# Altium project DD2088PoE_Daisy_Chain.PrjPcb (part 8 of 8)
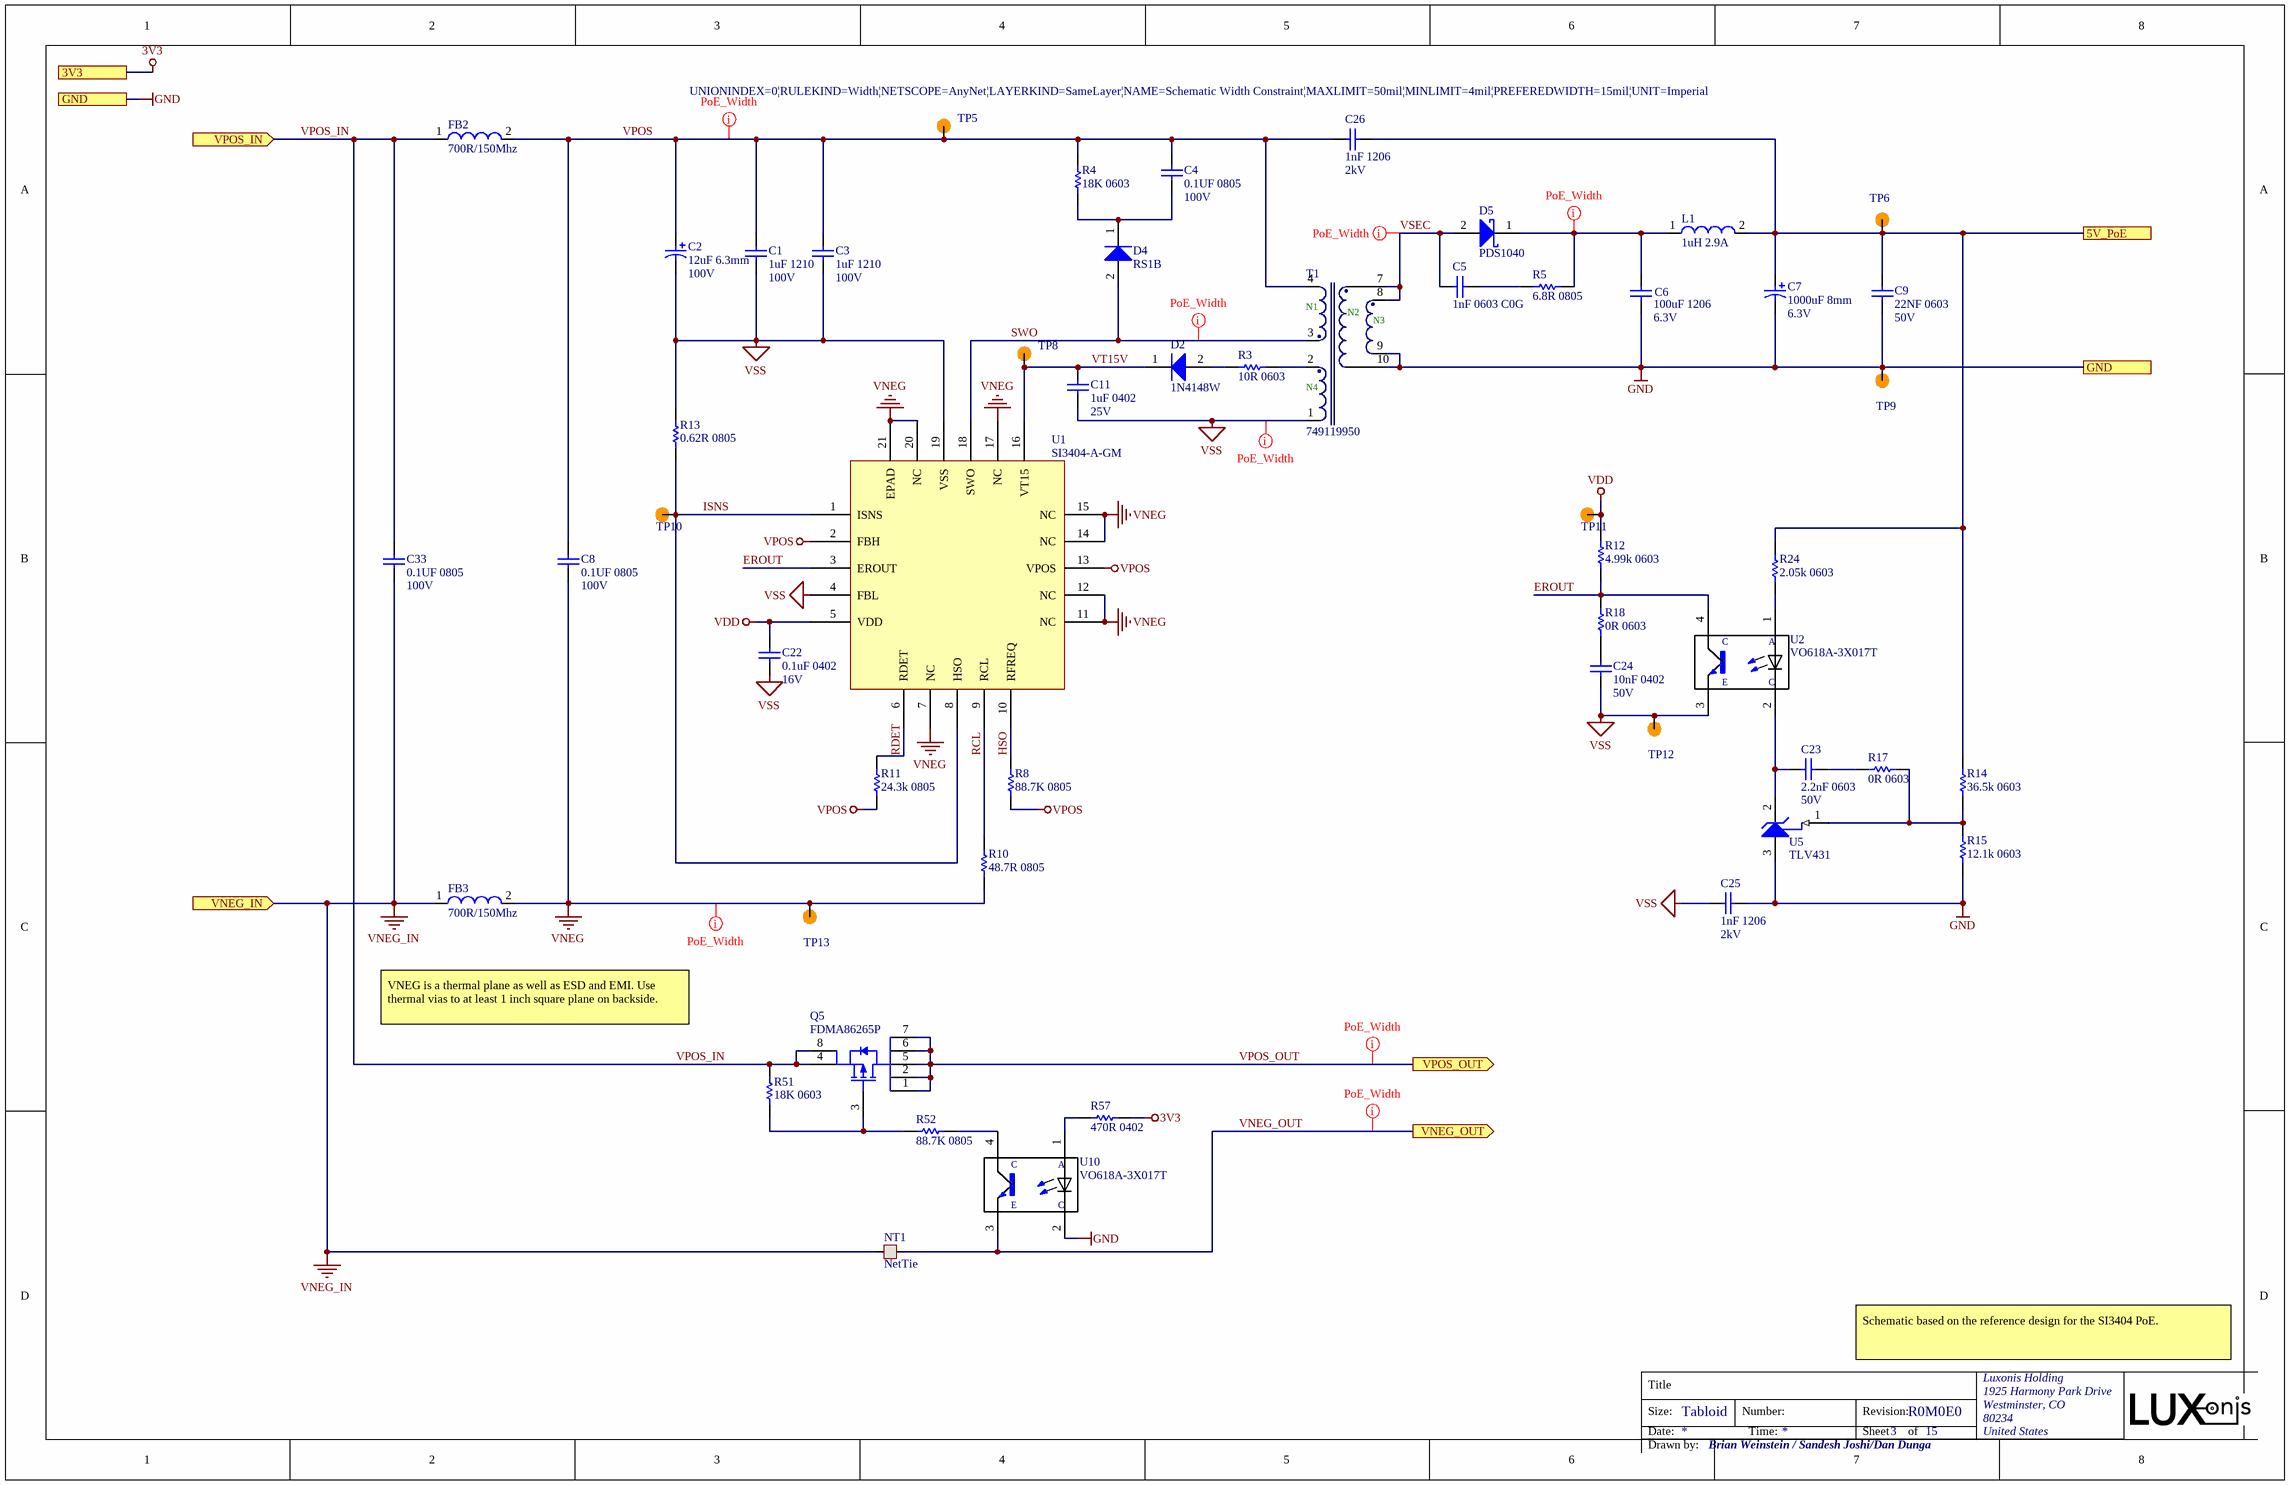
[diagram p16: PoE_Si3404.SchDoc]

## Sheet PoE_Si3404.SchDoc: =project_title (continued)

### Library data of the parts (continued)
R10 = RC0805FR-0748R7L: RES SMD 48.7 OHM 1% 1/8W 0805; Manufacturer 1: Yageo; Temperature Coefficient: 100ppm/°C; Power Rating: 125mW; Voltage Rating: 150V; Supplier 1: Digi-Key; Manufacturer Part Number 1: RC0805FR-0748R7L; Stock 1: 11096; Pricing 1: 1=0.10000, 10=0.04000, 100=0.01630, 1000=0.00731, 2500=0.00635 (USD); RoHS: Yes; Case/Package: 0805; Contact Plating: Tin,Matte; Case Code (Metric): 2012; Case Code (Imperial): 0805; Min Operating Temperature: -55°C; Max Operating Temperature: 155°C; Resistance: 48.7R; Tolerance: 1%; Composition: Thick Film; Package Quantity: 1; Packaging: Tape and Reel; Number of Terminations: 2; Termination: SMD/SMT; Military Standard: Not; Max Power Dissipation: 125mW; Voltage Rating (DC): 150V; Features: Moisture Resistant; Length: 2mm; Height: 0.024inch; Width: 0.049inch; Depth: 1.25mm; Radiation Hardening: No; Lead Free: Lead Free; ComponentLink1URL: https://datasheet.ciiva.com/2457/pyu-r-int-thick-7-2457344.pdf?src-supplier=Digi-Key; ComponentLink1Description: https://datasheet.ciiva.com/2457/pyu-r-int-thick-7-2457344.pdf?src-supplier=Digi-Key; ComponentLink2URL: https://datasheet.ciiva.com/2457/pyu-r-int-thick-7-2457345.pdf?src-supplier=Digi-Key; ComponentLink2Description: https://datasheet.ciiva.com/2457/pyu-r-int-thick-7-2457345.pdf?src-supplier=Digi-Key; ComponentLink3URL: https://datasheet.ciiva.com/2457/pyu-r-int-thick-7-2457346.pdf?src-supplier=Digi-Key; ComponentLink3Description: https://datasheet.ciiva.com/2457/pyu-r-int-thick-7-2457346.pdf?src-supplier=Digi-Key; Supplier 2: Mouser; Supplier 3: Arrow; Supplier Part Number 1: 311-48.7CRCT-ND; Supplier Part Number 2: 603-RC0805FR-0748R7L; Supplier Part Number 3: RC0805FR-0748R7L
R11 = CRCW080524K3FKEA: RES SMD 24.3K OHM 1% 1/8W 0805; Manufacturer 1: Vishay; Resistance: 24.3kR; Temperature Coefficient: 100ppm/°C; Power Rating: 125mW; Voltage Rating: 150V; Supplier 1: Digi-Key; Manufacturer Part Number 1: CRCW080524K3FKEA; Stock 1: 7150; Pricing 1: 1=0.10000, 10=0.06200, 100=0.02540, 1000=0.01142, 2500=0.00991 (USD); RoHS: Yes; Mount: Surface Mount; Case/Package: 0805; Number of Pins: 2; Weight: 0.000194oz; Contact Plating: Tin; Case Code (Imperial): 0805; Case Code (Metric): 2012; Min Operating Temperature: -55°C; Max Operating Temperature: 155°C; Tolerance: 1%; Packaging: Tape and Reel; Composition: Thick Film; Package Quantity: 10; Termination: SMD/SMT; Number of Terminations: 2; Max Power Dissipation: 125mW; Features: Automotive AEC-Q200; Military Standard: Not; Voltage Rating (DC): 150V; Working Voltage: 150V; Length: 2mm; Height: 0.45mm; Width: 1.25mm; Depth: 1.25mm; Radiation Hardening: No; Lead Free: Lead Free; REACH SVHC: Unknown; ComponentLink1URL: https://datasheet.ciiva.com/11811/0900766b80d98b26-11811485.pdf?src-supplier=RSComponents; ComponentLink1Description: https://datasheet.ciiva.com/11811/0900766b80d98b26-11811485.pdf?src-supplier=RSComponents; ComponentLink2URL: https://datasheet.ciiva.com/5544/dcrcwe3-109170-5544277.pdf?src-supplier=Mouser; ComponentLink2Description: https://datasheet.ciiva.com/5544/dcrcwe3-109170-5544277.pdf?src-supplier=Mouser; ComponentLink3URL: https://datasheet.ciiva.com/2467/dcrcwe3-2467350.pdf?src-supplier=Digi-Key; ComponentLink3Description: https://datasheet.ciiva.com/2467/dcrcwe3-2467350.pdf?src-supplier=Digi-Key; ComponentLink4URL: https://datasheet.ciiva.com/3258/dcrcwe3-3258365.pdf?src-supplier=Avnet; ComponentLink4Description: https://datasheet.ciiva.com/3258/dcrcwe3-3258365.pdf?src-supplier=Avnet; ComponentLink5URL: https://datasheet.ciiva.com/2467/dcrcwe3-2467351.pdf?src-supplier=Digi-Key; ComponentLink5Description: https://datasheet.ciiva.com/2467/dcrcwe3-2467351.pdf?src-supplier=Digi-Key; ComponentLink6URL: https://datasheet.ciiva.com/2467/dcrcwe3-2467352.pdf?src-supplier=Digi-Key; ComponentLink6Description: https://datasheet.ciiva.com/2467/dcrcwe3-2467352.pdf?src-supplier=Digi-Key; ComponentLink7URL: https://datasheet.ciiva.com/22872/70201119-22872331.pdf?src-supplier=Allied+Electronics; ComponentLink7Description: https://datasheet.ciiva.com/22872/70201119-22872331.pdf?src-supplier=Allied+Electronics; ComponentLink8URL: https://datasheet.ciiva.com/3258/dcrcwe3-3258364.pdf?src-supplier=Avnet; ComponentLink8Description: https://datasheet.ciiva.com/3258/dcrcwe3-3258364.pdf?src-supplier=Avnet; ComponentLink9URL: https://datasheet.ciiva.com/17183/dcrcwe3-17183388.pdf?src-supplier=Avnet+Europe; ComponentLink9Description: https://datasheet.ciiva.com/17183/dcrcwe3-17183388.pdf?src-supplier=Avnet+Europe; ComponentLink10URL: https://datasheet.ciiva.com/22705/1697337-22705870.pdf?src-supplier=Element14; ComponentLink10Description: https://datasheet.ciiva.com/22705/1697337-22705870.pdf?src-supplier=Element14; ComponentLink11URL: https://datasheet.ciiva.com/16202/dcrcwe3-16202447.pdf?src-supplier=Future+Electronics; ComponentLink11Description: https://datasheet.ciiva.com/16202/dcrcwe3-16202447.pdf?src-supplier=Future+Electronics; Supplier 2: Newark; Supplier 3: Mouser; Supplier Part Number 1: 541-24.3KCCT-ND; Supplier Part Number 2: 53K0042; Supplier Part Number 3: 71-CRCW0805-24.3K-E3
R12 = RC0603FR-074K99L: RES SMD 4.99K OHM 1% 1/10W 0603; Manufacturer 1: Yageo; Resistance: 4.99kR; Temperature Coefficient: 100ppm/°C; Voltage Rating (DC): 50V; Power Rating: 100mW; Voltage Rating: 75V; Supplier 1: Digi-Key; Manufacturer Part Number 1: RC0603FR-074K99L; Stock 1: 4263956; Pricing 1: 1=0.10000, 10=0.02300, 100=0.00940, 1000=0.00421, 2500=0.00366 (USD); RoHS: Yes; Case/Package: 0603; Number of Pins: 2; Weight: 7.1E-05oz; Case Code (Imperial): 0603; Case Code (Metric): 1608; Min Operating Temperature: -55°C; Max Operating Temperature: 155°C; Tolerance: 1%; Packaging: Tape and Reel; Composition: Thick Film; Package Quantity: 1; Termination: SMD/SMT; Number of Terminations: 2; Military Standard: Not; Max Power Dissipation: 100mW; Features: Moisture Resistant; Length: 1.6mm; Height: 0.45mm; Width: 0.8mm; Depth: 0.8mm; Lead Free: Lead Free; REACH SVHC: Unknown; ComponentLink1URL: https://datasheet.ciiva.com/22747/443971-22747529.pdf?src-supplier=Element14; ComponentLink1Description: https://datasheet.ciiva.com/22747/443971-22747529.pdf?src-supplier=Element14; ComponentLink2URL: https://datasheet.ciiva.com/2453/pyu-r-int-thick-7-2453979.pdf?src-supplier=Digi-Key; ComponentLink2Description: https://datasheet.ciiva.com/2453/pyu-r-int-thick-7-2453979.pdf?src-supplier=Digi-Key; ComponentLink3URL: https://datasheet.ciiva.com/2453/pyu-r-int-thick-7-2453980.pdf?src-supplier=Digi-Key; ComponentLink3Description: https://datasheet.ciiva.com/2453/pyu-r-int-thick-7-2453980.pdf?src-supplier=Digi-Key; ComponentLink4URL: https://datasheet.ciiva.com/2453/pyu-r-int-thick-7-2453981.pdf?src-supplier=Digi-Key; ComponentLink4Description: https://datasheet.ciiva.com/2453/pyu-r-int-thick-7-2453981.pdf?src-supplier=Digi-Key; ComponentLink5URL: https://datasheet.ciiva.com/7983/443971-7983646.pdf?src-supplier=Element14; ComponentLink5Description: https://datasheet.ciiva.com/7983/443971-7983646.pdf?src-supplier=Element14; Supplier 2: Newark; Supplier 3: Mouser; Supplier Part Number 2: 66R2367; Supplier Part Number 1: 311-4.99KHRCT-ND; Supplier Part Number 3: 603-RC0603FR-074K99L
R13 = RL0805FR-070R62L: RES SMD 620 MOHM 1% 1/8W 0805; Manufacturer 1: Yageo; Resistance: 620mR; Power Rating: 125mW; Temperature Coefficient: 200ppm/°C; Voltage Rating (DC): 300V; Supplier 1: Digi-Key; Manufacturer Part Number 1: RL0805FR-070R62L; Stock 1: 16217; Pricing 1: 1=0.33000, 10=0.28200, 100=0.11030, 1000=0.04619, 2500=0.04234 (USD); RoHS: Yes; Case/Package: 0805; Weight: 0.000194oz; Case Code (Metric): 2012; Case Code (Imperial): 0805; Contact Plating: Tin,Matte; Min Operating Temperature: -55°C; Max Operating Temperature: 125°C; Packaging: Tape and Reel; Tolerance: 1%; Package Quantity: 1; Composition: Thick Film; Termination: SMD/SMT; Number of Terminations: 2; Max Power Dissipation: 125mW; Features: Moisture Resistant; Length: 0.079inch; Height: 0.024inch; Width: 0.049inch; Radiation Hardening: No; Lead Free: Lead Free; ComponentLink1URL: https://datasheet.ciiva.com/15328/pyu-rl-521-rohs-l-5-15328303.pdf?src-supplier=Mouser; ComponentLink1Description: https://datasheet.ciiva.com/15328/pyu-rl-521-rohs-l-5-15328303.pdf?src-supplier=Mouser; Supplier 2: Mouser; Supplier 3: Future Electronics; Supplier Part Number 1: 311-.62SCT-ND; Supplier Part Number 2: 603-RL0805FR-070R62L; Supplier Part Number 3: RL0805FR-070R62L-CUTT
R14 = RC0603FR-0736K5L: RES SMD 36.5K OHM 1% 1/10W 0603; Manufacturer 1: Yageo; Resistance: 36.5kR; Power Rating: 100mW; Voltage Rating: 50V; Temperature Coefficient: 100ppm/°C; Working Voltage: 75V; Supplier 1: Digi-Key; Manufacturer Part Number 1: RC0603FR-0736K5L; Stock 1: 763857; Pricing 1: 1=0.10000, 10=0.02300, 100=0.00940, 1000=0.00421, 2500=0.00366 (USD); RoHS: Yes; Case/Package: 0603; Case Code (Metric): 1608; Case Code (Imperial): 0603; Min Operating Temperature: -55°C; Max Operating Temperature: 155°C; Package Quantity: 1; Tolerance: 1%; Packaging: Tape and Reel; Composition: Thick Film; Number of Terminations: 2; Termination: SMD/SMT; Military Standard: Not; Max Power Dissipation: 100mW; Voltage Rating (DC): 50V; Features: Moisture Resistant; Length: 0.063inch; Height: 0.022inch; Width: 0.031inch; Depth: 0.8mm; Lead Free: Lead Free; ComponentLink1URL: https://datasheet.ciiva.com/2491/pyu-r-int-thick-7-2491306.pdf?src-supplier=Digi-Key; ComponentLink1Description: https://datasheet.ciiva.com/2491/pyu-r-int-thick-7-2491306.pdf?src-supplier=Digi-Key; ComponentLink2URL: https://datasheet.ciiva.com/2491/pyu-r-int-thick-7-2491307.pdf?src-supplier=Digi-Key; ComponentLink2Description: https://datasheet.ciiva.com/2491/pyu-r-int-thick-7-2491307.pdf?src-supplier=Digi-Key; ComponentLink3URL: https://datasheet.ciiva.com/2491/pyu-r-int-thick-7-2491308.pdf?src-supplier=Digi-Key; ComponentLink3Description: https://datasheet.ciiva.com/2491/pyu-r-int-thick-7-2491308.pdf?src-supplier=Digi-Key; Supplier 2: Mouser; Supplier 3: Future Electronics; Supplier Part Number 1: 311-36.5KHRCT-ND; Supplier Part Number 2: 603-RC0603FR-0736K5L; Supplier Part Number 3: RC0603FR-0736K5L-CUTT
R15 = RC0603FR-0712K1L: RES SMD 12.1K OHM 1% 1/10W 0603; Manufacturer 1: Yageo; Power Rating: 100mW; Temperature Coefficient: 100ppm/°C; Resistance: 12.1kR; Voltage Rating: 50V; Supplier 1: Digi-Key; Manufacturer Part Number 1: RC0603FR-0712K1L; Stock 1: 267774; Pricing 1: 1=0.10000, 10=0.02300, 100=0.00940, 1000=0.00421, 2500=0.00366 (USD); RoHS: Yes; Case/Package: 0603; Number of Pins: 2; Case Code (Metric): 1608; Case Code (Imperial): 0603; Min Operating Temperature: -55°C; Max Operating Temperature: 155°C; Tolerance: 1%; Package Quantity: 1; Packaging: Tape and Reel; Composition: Thick Film; Number of Terminations: 2; Termination: SMD/SMT; Military Standard: Not; Max Power Dissipation: 100mW; Voltage Rating (DC): 50V; Features: Moisture Resistant; Length: 1.6mm; Height: 0.022inch; Depth: 0.8mm; Width: 0.031inch; REACH SVHC: No SVHC; Lead Free: Lead Free; ComponentLink1URL: https://datasheet.ciiva.com/2519/pyu-r-int-thick-7-2519216.pdf?src-supplier=Digi-Key; ComponentLink1Description: https://datasheet.ciiva.com/2519/pyu-r-int-thick-7-2519216.pdf?src-supplier=Digi-Key; ComponentLink2URL: https://datasheet.ciiva.com/2519/pyu-r-int-thick-7-2519217.pdf?src-supplier=Digi-Key; ComponentLink2Description: https://datasheet.ciiva.com/2519/pyu-r-int-thick-7-2519217.pdf?src-supplier=Digi-Key; ComponentLink3URL: https://datasheet.ciiva.com/2519/pyu-r-int-thick-7-2519218.pdf?src-supplier=Digi-Key; ComponentLink3Description: https://datasheet.ciiva.com/2519/pyu-r-int-thick-7-2519218.pdf?src-supplier=Digi-Key; ComponentLink4URL: https://datasheet.ciiva.com/15159/getdatasheetpartid-28802-15159207.pdf?src-supplier=Verical; ComponentLink4Description: https://datasheet.ciiva.com/15159/getdatasheetpartid-28802-15159207.pdf?src-supplier=Verical; ComponentLink5URL: https://datasheet.ciiva.com/12558/rc0603-272842-12558574.pdf?src-supplier=Mouser; ComponentLink5Description: https://datasheet.ciiva.com/12558/rc0603-272842-12558574.pdf?src-supplier=Mouser; ComponentLink6URL: https://datasheet.ciiva.com/46395/443971-46395022.pdf?src-supplier=Element14; ComponentLink6Description: https://datasheet.ciiva.com/46395/443971-46395022.pdf?src-supplier=Element14; Supplier 2: Newark; Supplier 3: Mouser; Supplier Part Number 3: 603-RC0603FR-0712K1L; Supplier Part Number 2: 66R2021; Supplier Part Number 1: 311-12.1KHRCT-ND
R17 R18 = CRCW06030000Z0EA: RES SMD 0 OHM JUMPER 1/10W 0603 0 Ohms Jumper 0.1W, 1/10W Chip Resistor 0603 (1608 Metric) Automotive AEC-Q200 Thick Film; Manufacturer 1: Vishay; Manufacturer Part Number 1: CRCW0603-0000Z0EA; Resistance: 0mR; Power Rating: 100mW; Voltage Rating: 75V; Temperature Coefficient: 100ppm/°C; Tolerance: 5%; Current Rating: 2A; Supplier 1: Digi-Key; Stock 1: 742743; Pricing 1: 1=0.100000, 10=0.034000, 25=0.024400, 50=0.018600, 100=0.013800, 250=0.010480, 500=0.008400, 1000=0.006180 (USD); RoHS: Yes; Mount: Surface Mount; Case/Package: 0603; Weight: 7.1E-05oz; Contact Plating: Tin,Lead; Case Code (Metric): 1608; Case Code (Imperial): 0603; Min Operating Temperature: -55°C; Max Operating Temperature: 155°C; Composition: Thick Film; Termination: SMD/SMT; Packaging: Tape and Reel; Package Quantity: 1; Number of Terminations: 2; Military Standard: Not; Max Power Dissipation: 100mW; Voltage Rating (DC): 75V; Features: Automotive AEC-Q200; Working Voltage: 75V; Length: 1.55mm; Height: 0.02inch; Width: 0.033inch; Depth: 0.85mm; Radiation Hardening: No; Lead Free: Lead Free; REACH SVHC: Unknown; ComponentLink1URL: https://datasheet.ciiva.com/2461/dcrcwe3-2461968.pdf?src-supplier=Digi-Key; ComponentLink1Description: https://datasheet.ciiva.com/2461/dcrcwe3-2461968.pdf?src-supplier=Digi-Key; ComponentLink2URL: https://datasheet.ciiva.com/2461/dcrcwe3-2461969.pdf?src-supplier=Digi-Key; ComponentLink2Description: https://datasheet.ciiva.com/2461/dcrcwe3-2461969.pdf?src-supplier=Digi-Key; ComponentLink3URL: https://datasheet.ciiva.com/2461/dcrcwe3-2461970.pdf?src-supplier=Digi-Key; ComponentLink3Description: https://datasheet.ciiva.com/2461/dcrcwe3-2461970.pdf?src-supplier=Digi-Key; ComponentLink4URL: https://datasheet.ciiva.com/8340/dcrcwe3-8340197.pdf?src-supplier=Avnet; ComponentLink4Description: https://datasheet.ciiva.com/8340/dcrcwe3-8340197.pdf?src-supplier=Avnet; ComponentLink5URL: https://datasheet.ciiva.com/16941/dcrcw-16941302.pdf?src-supplier=Avnet+Europe; ComponentLink5Description: https://datasheet.ciiva.com/16941/dcrcw-16941302.pdf?src-supplier=Avnet+Europe; ComponentLink6URL: https://datasheet.ciiva.com/16199/dcrcwe3-16199063.pdf?src-supplier=Future+Electronics; ComponentLink6Description: https://datasheet.ciiva.com/16199/dcrcwe3-16199063.pdf?src-supplier=Future+Electronics; ComponentLink7URL: https://datasheet.ciiva.com/16725/70201119-16725175.pdf?src-supplier=Allied+Electronics; ComponentLink7Description: https://datasheet.ciiva.com/16725/70201119-16725175.pdf?src-supplier=Allied+Electronics; ComponentLink8URL: https://datasheet.ciiva.com/26316/fld-crcw-e3-data-en-26316615.pdf?src-supplier=Distrelec; ComponentLink8Description: https://datasheet.ciiva.com/26316/fld-crcw-e3-data-en-26316615.pdf?src-supplier=Distrelec; ComponentLink9URL: https://datasheet.ciiva.com/5544/dcrcwe3-109170-5544344.pdf?src-supplier=Mouser; ComponentLink9Description: https://datasheet.ciiva.com/5544/dcrcwe3-109170-5544344.pdf?src-supplier=Mouser; ComponentLink10URL: https://datasheet.ciiva.com/7841/1720486-7841816.pdf?src-supplier=Element14; ComponentLink10Description: https://datasheet.ciiva.com/7841/1720486-7841816.pdf?src-supplier=Element14; ComponentLink11URL: https://datasheet.ciiva.com/7841/1720486-7841817.pdf?src-supplier=Element14; ComponentLink11Description: https://datasheet.ciiva.com/7841/1720486-7841817.pdf?src-supplier=Element14; ComponentLink12URL: https://datasheet.ciiva.com/7841/125364-7841818.pdf?src-supplier=Element14; ComponentLink12Description: https://datasheet.ciiva.com/7841/125364-7841818.pdf?src-supplier=Element14; ComponentLink13URL: https://datasheet.ciiva.com/16721/70201119-16721450.pdf?src-supplier=Allied+Electronics; ComponentLink13Description: https://datasheet.ciiva.com/16721/70201119-16721450.pdf?src-supplier=Allied+Electronics; Supplier Part Number 1: 541-0.0GCT-ND
R24 = RC0603FR-072K05L: RES SMD 2.05K OHM 1% 1/10W 0603; Manufacturer 1: Yageo; Resistance: 2.05kR; Power Rating: 100mW; Voltage Rating: 50V; Temperature Coefficient: 100ppm/°C; Supplier 1: Digi-Key; Manufacturer Part Number 1: RC0603FR-072K05L; Stock 1: 238970; Pricing 1: 1=0.10000, 10=0.02300, 100=0.00940, 1000=0.00421, 2500=0.00366 (USD); RoHS: Yes; Mount: Surface Mount; Case/Package: 0603; Case Code (Metric): 1608; Case Code (Imperial): 0603; Min Operating Temperature: -55°C; Max Operating Temperature: 155°C; Tolerance: 1%; Package Quantity: 1; Packaging: Tape and Reel; Composition: Thick Film; Number of Terminations: 2; Termination: SMD/SMT; Military Standard: Not; Max Power Dissipation: 100mW; Voltage Rating (DC): 50V; Features: Moisture Resistant; Length: 1.6mm; Height: 0.45mm; Width: 0.031inch; Depth: 0.8mm; Lead Free: Lead Free; ComponentLink1URL: https://datasheet.ciiva.com/11819/0900766b80f96399-11819302.pdf?src-supplier=RSComponents; ComponentLink1Description: https://datasheet.ciiva.com/11819/0900766b80f96399-11819302.pdf?src-supplier=RSComponents; ComponentLink2URL: https://datasheet.ciiva.com/2454/pyu-r-int-thick-7-2454210.pdf?src-supplier=Digi-Key; ComponentLink2Description: https://datasheet.ciiva.com/2454/pyu-r-int-thick-7-2454210.pdf?src-supplier=Digi-Key; ComponentLink3URL: https://datasheet.ciiva.com/2454/pyu-r-int-thick-7-2454211.pdf?src-supplier=Digi-Key; ComponentLink3Description: https://datasheet.ciiva.com/2454/pyu-r-int-thick-7-2454211.pdf?src-supplier=Digi-Key; ComponentLink4URL: https://datasheet.ciiva.com/2454/pyu-r-int-thick-7-2454212.pdf?src-supplier=Digi-Key; ComponentLink4Description: https://datasheet.ciiva.com/2454/pyu-r-int-thick-7-2454212.pdf?src-supplier=Digi-Key; Supplier 2: Mouser; Supplier 3: Future Electronics; Supplier Part Number 1: 311-2.05KHRCT-ND; Supplier Part Number 2: 603-RC0603FR-072K05L; Supplier Part Number 3: RC0603FR-072K05L-CUTT
R57 = CRCW0402470RFKED: RES SMD 470 OHM 1% 1/16W 0402; Manufacturer 1: Vishay; Temperature Coefficient: 100ppm/°C; Power Rating: 63mW; Voltage Rating: 50V; Supplier 1: Digi-Key; Manufacturer Part Number 1: CRCW0402470RFKED; Stock 1: 9199; Pricing 1: 1=0.10000, 10=0.03800, 100=0.01540, 1000=0.00690, 2500=0.00599, 5000=0.00495 (USD); RoHS: Yes; Case/Package: 0402; Weight: 2.3E-05oz; Case Code (Imperial): 0402; Case Code (Metric): 1005; Min Operating Temperature: -55°C; Max Operating Temperature: 155°C; Packaging: Tape and Reel; Resistance: 470R; Tolerance: 1%; Composition: Thick Film; Voltage Rating (DC): 50V; Termination: SMD/SMT; Military Standard: Not; Length: 1mm; Height: 0.35mm; Width: 0.5mm; Depth: 0.5mm; Lead Free: Lead Free; ComponentLink1URL: https://datasheet.ciiva.com/11811/0900766b80d98824-11811416.pdf?src-supplier=RSComponents; ComponentLink1Description: https://datasheet.ciiva.com/11811/0900766b80d98824-11811416.pdf?src-supplier=RSComponents; Supplier 2: Newark; Supplier Part Number 1: 541-470LCT-ND; Supplier Part Number 2: 26W9133; Mount: Surface Mount; Contact Plating: Tin; Number of Terminations: 2; Package Quantity: 10; Max Power Dissipation: 63mW; Features: Automotive AEC-Q200; Radiation Hardening: No; REACH SVHC: Unknown; ComponentLink2URL: https://datasheet.ciiva.com/16764/70201119-16764886.pdf?src-supplier=Allied+Electronics; ComponentLink2Description: https://datasheet.ciiva.com/16764/70201119-16764886.pdf?src-supplier=Allied+Electronics; ComponentLink3URL: https://datasheet.ciiva.com/28613/1720486-28613479.pdf?src-supplier=Element14; ComponentLink3Description: https://datasheet.ciiva.com/28613/1720486-28613479.pdf?src-supplier=Element14; ComponentLink4URL: https://datasheet.ciiva.com/3256/dcrcwe3-3256553.pdf?src-supplier=Avnet; ComponentLink4Description: https://datasheet.ciiva.com/3256/dcrcwe3-3256553.pdf?src-supplier=Avnet; ComponentLink5URL: https://datasheet.ciiva.com/7777/1720486-7777243.pdf?src-supplier=Element14; ComponentLink5Description: https://datasheet.ciiva.com/7777/1720486-7777243.pdf?src-supplier=Element14; ComponentLink6URL: https://datasheet.ciiva.com/8336/dcrcwe3-8336715.pdf?src-supplier=Avnet; ComponentLink6Description: https://datasheet.ciiva.com/8336/dcrcwe3-8336715.pdf?src-supplier=Avnet; ComponentLink7URL: https://datasheet.ciiva.com/7777/1697337-7777244.pdf?src-supplier=Element14; ComponentLink7Description: https://datasheet.ciiva.com/7777/1697337-7777244.pdf?src-supplier=Element14; ComponentLink8URL: https://datasheet.ciiva.com/2463/dcrcwe3-2463085.pdf?src-supplier=Digi-Key; ComponentLink8Description: https://datasheet.ciiva.com/2463/dcrcwe3-2463085.pdf?src-supplier=Digi-Key; ComponentLink9URL: https://datasheet.ciiva.com/16362/dcrcwe3-16362109.pdf?src-supplier=Future+Electronics; ComponentLink9Description: https://datasheet.ciiva.com/16362/dcrcwe3-16362109.pdf?src-supplier=Future+Electronics; ComponentLink10URL: https://datasheet.ciiva.com/16882/dcrcwe3-16882493.pdf?src-supplier=Avnet+Europe; ComponentLink10Description: https://datasheet.ciiva.com/16882/dcrcwe3-16882493.pdf?src-supplier=Avnet+Europe; ComponentLink11URL: https://datasheet.ciiva.com/2463/dcrcwe3-2463086.pdf?src-supplier=Digi-Key; ComponentLink11Description: https://datasheet.ciiva.com/2463/dcrcwe3-2463086.pdf?src-supplier=Digi-Key; ComponentLink12URL: https://datasheet.ciiva.com/2463/dcrcwe3-2463087.pdf?src-supplier=Digi-Key; ComponentLink12Description: https://datasheet.ciiva.com/2463/dcrcwe3-2463087.pdf?src-supplier=Digi-Key
T1 = 749119950: TRANS FLYBACK POE 127UH SMD; Manufacturer 1: Wurth Electronics; Current Rating: 1.3A; Power Rating: 13W; Max Input Voltage: 57V; Min Input Voltage: 36V; Output Voltage: 5V; Frequency: 500kHz; ComponentLink2URL: http://www.we-online.de/katalog/media/pdf/749119950.pdf; ComponentLink2Description: Datasheet; ComponentLink1Description: Manufacturer URL; ComponentLink1URL: http://www.we-online.com; Supplier 1: Digi-Key; Manufacturer Part Number 1: 749119950; Stock 1: 148; Pricing 1: 1=5.64000, 10=5.44300, 50=5.14100, 100=4.83800 (USD); RoHS: Yes; Mount: Surface Mount; Case/Package: SMD/SMT; Min Operating Temperature: -40°C; Max Operating Temperature: 125°C; Package Quantity: 1; Packaging: Tape and Reel; Inductance: 127uH; Length: 13.5mm; Height: 12.5mm; Width: 17.75mm; Height - Seated (Max): 12.5mm; REACH SVHC: No SVHC; ComponentLink3URL: https://datasheet.ciiva.com/1378/749119950-1378246.pdf?src-supplier=Element14; ComponentLink3Description: https://datasheet.ciiva.com/1378/749119950-1378246.pdf?src-supplier=Element14; ComponentLink4URL: https://datasheet.ciiva.com/5309/749119950-91646-5309801.pdf?src-supplier=Mouser; ComponentLink4Description: https://datasheet.ciiva.com/5309/749119950-91646-5309801.pdf?src-supplier=Mouser; ComponentLink5URL: https://datasheet.ciiva.com/1386/749119950-1386647.pdf?src-supplier=Farnell; ComponentLink5Description: https://datasheet.ciiva.com/1386/749119950-1386647.pdf?src-supplier=Farnell; ComponentLink6URL: https://datasheet.ciiva.com/2940/749119950-2940138.pdf?src-supplier=Digi-Key; ComponentLink6Description: https://datasheet.ciiva.com/2940/749119950-2940138.pdf?src-supplier=Digi-Key; ComponentLink7URL: https://datasheet.ciiva.com/2940/749119950-2940139.pdf?src-supplier=Digi-Key; ComponentLink7Description: https://datasheet.ciiva.com/2940/749119950-2940139.pdf?src-supplier=Digi-Key; Supplier 2: Digi-Key; Supplier 3: Mouser; Supplier Part Number 1: 732-2432-1-ND; Supplier Part Number 2: 732-2432-6-ND; Supplier Part Number 3: 710-749119950
TP5 TP6 TP8-TP13 = TEST_POINT
U1 = SI3404-A-GM: IC POE CNTRL 1 CHANNEL 20QFN; Manufacturer 1: Silicon Labs; Supplier 1: Digi-Key; Manufacturer Part Number 1: SI3404-A-GM; Stock 1: 1481; Pricing 1: 1=1.46000, 25=1.41040, 100=1.35600, 1000=1.33340 (USD); RoHS: No; ComponentLink1URL: https://www.silabs.com/documents/public/data-sheets/si3404-datasheet.pdf?src-supplier=Digi-Key; ComponentLink1Description: https://www.silabs.com/documents/public/data-sheets/si3404-datasheet.pdf?src-supplier=Digi-Key; Supplier 2: Mouser; Supplier Part Number 1: 336-4270-ND; Supplier Part Number 2: 634-SI3404-A-GM
U2 U10 = VO618A-3X017T: OPTOISOLATOR 5.3KV TRANS 4-SMD; Manufacturer 1: Vishay Semiconductors; Max Power Dissipation: 150mW; Collector Emitter Voltage (VCEO): 80V; Collector Emitter Saturation Voltage: 400mV; Max Collector Current: 50mA; Max Input Current: 60mA; Number of Channels: 1; Reverse Breakdown Voltage: 6V; Forward Voltage: 1.1V; Current Transfer Ratio: 100%; Supplier 1: Digi-Key; Manufacturer Part Number 1: VO618A-3X017T; Stock 1: 28306; Pricing 1: 1=1.04000, 10=0.80900, 100=0.51980, 500=0.43890 (USD); RoHS: Yes; Mount: Surface Mount; Case/Package: SMD/SMT; Number of Pins: 4; Contact Plating: Tin; Min Operating Temperature: -55°C; Max Operating Temperature: 110°C; Packaging: Tape and Reel; Package Quantity: 1; Forward Current: 60mA; Max Output Voltage: 80V; Output Current per Channel: 50mA; Isolation Voltage: 5.3kV; Number of Elements: 1; Power Dissipation: 150mW; Input Current: 60mA; Radiation Hardening: No; REACH SVHC: Unknown; Lead Free: Lead Free; ComponentLink1URL: https://datasheet.ciiva.com/26183/vo618a-26183397.pdf?src-supplier=Avnet+Europe; ComponentLink1Description: https://datasheet.ciiva.com/26183/vo618a-26183397.pdf?src-supplier=Avnet+Europe; ComponentLink2URL: https://datasheet.ciiva.com/2087/vo618a-2087431.pdf?src-supplier=Digi-Key; ComponentLink2Description: https://datasheet.ciiva.com/2087/vo618a-2087431.pdf?src-supplier=Digi-Key; ComponentLink3URL: https://datasheet.ciiva.com/2087/vo618a-2087432.pdf?src-supplier=Digi-Key; ComponentLink3Description: https://datasheet.ciiva.com/2087/vo618a-2087432.pdf?src-supplier=Digi-Key; ComponentLink4URL: https://datasheet.ciiva.com/2087/vo618a-2087433.pdf?src-supplier=Digi-Key; ComponentLink4Description: https://datasheet.ciiva.com/2087/vo618a-2087433.pdf?src-supplier=Digi-Key; Supplier 2: Newark; Supplier 3: Mouser; Supplier Part Number 1: VO618A-3X017TCT-ND; Supplier Part Number 2: 48W3695; Supplier Part Number 3: 78-VO618A-3X017T
U5 = TLV431BCDBZR: IC VREF SHUNT ADJ SOT23-3; Manufacturer 1: Texas Instruments; Tolerance: 0.5%; Max Input Voltage: 7V; Output Voltage: 6V; Max Output Current: 15mA; Temperature Coefficient: 129ppm/°C; Cathode Current: 100uA; Reference Type: Shunt,Adjustable; Number of Channels: 1; Min Input Voltage: 1.24V; Supplier 1: Digi-Key; Manufacturer Part Number 1: TLV431BCDBZR; Stock 1: 3209; Pricing 1: 1=0.92000, 10=0.81200, 100=0.57850, 500=0.46772, 1000=0.35695 (USD); RoHS: Yes; Case/Package: SOT-23; Number of Pins: 3; Min Operating Temperature: -40°C; Max Operating Temperature: 125°C; Packaging: Tape and Reel; Package Quantity: 1; Output Current: 15mA; Max Output Voltage: 6V; Reference Voltage: 6V; Radiation Hardening: No; Lead Free: Lead Free; REACH SVHC: No SVHC; ComponentLink1URL: https://datasheet.ciiva.com/26889/tlv431bcdbzr-26889546.pdf?src-supplier=IIIC; ComponentLink1Description: https://datasheet.ciiva.com/26889/tlv431bcdbzr-26889546.pdf?src-supplier=IIIC; ComponentLink2URL: https://datasheet.ciiva.com/2006/tlv431a-2006546.pdf?src-supplier=Digi-Key; ComponentLink2Description: https://datasheet.ciiva.com/2006/tlv431a-2006546.pdf?src-supplier=Digi-Key; ComponentLink3URL: https://datasheet.ciiva.com/2006/tlv431a-2006547.pdf?src-supplier=Digi-Key; ComponentLink3Description: https://datasheet.ciiva.com/2006/tlv431a-2006547.pdf?src-supplier=Digi-Key; ComponentLink4URL: https://datasheet.ciiva.com/2006/tlv431a-2006548.pdf?src-supplier=Digi-Key; ComponentLink4Description: https://datasheet.ciiva.com/2006/tlv431a-2006548.pdf?src-supplier=Digi-Key; ComponentLink5URL: https://datasheet.ciiva.com/26264/tlv431b-26264234.pdf?src-supplier=Avnet+Europe; ComponentLink5Description: https://datasheet.ciiva.com/26264/tlv431b-26264234.pdf?src-supplier=Avnet+Europe; ComponentLink6URL: https://datasheet.ciiva.com/46397/1887487-46397709.pdf?src-supplier=Element14; ComponentLink6Description: https://datasheet.ciiva.com/46397/1887487-46397709.pdf?src-supplier=Element14; Supplier 2: TI store; Supplier 3: Mouser; Supplier Part Number 1: 296-17569-1-ND; Supplier Part Number 2: TLV431BCDBZR; Supplier Part Number 3: 595-TLV431BCDBZR

## Nets that join several sheets
1V2: POWER_GEN (C64.2 L4.2 R75.1), Ethernet_Switch (20 pins)
1V8: ETH_PCIE_PHY (C52.2 R50.2 U6.3), PCIE_CLK (C18.2 R6.2 U3.3), BOOT_JTAG_AUX (8 pins), POWER_GEN (C63.2 TP3.1 U8.5), DD2088PoE_Daisy_Chain_IMU (8 pins)
2V5: POWER_GEN (C59.2 U13.1), Ethernet_Switch (FB4.1)
3V3: ETH_PCIE_PHY (20 pins), PCIE_CLK (21 pins), DD2088PoE_Daisy_Chain_USB (C74.2 R186.2 U61.6), BOOT_JTAG_AUX (C55.2 J4.9 J7.4), POWER_GEN (9 pins), DD2088PoE_Daisy_Chain_IMU (C90.2 C91.2 U12.3), RJ45_1 (J1.15 J1.17), RJ45_2 (J10.15 J10.17), DD2088PoE_Daisy_Chain_CAM (6 pins), Ethernet_Switch (11 pins), PoE_Si3404 (R57.2)
5V_PoE: CONNECTOR_B (8 pins), BOOT_JTAG_AUX (R53.2 R54.2 R55.2 R56.2), POWER_GEN (6 pins), PoE_Si3404 (7 pins)
GND: TopLevel (6 pins), CONNECTOR_B (23 pins), CONNECTOR_A (20 pins), ETH_PCIE_PHY (24 pins), PCIE_CLK (21 pins), DD2088PoE_Daisy_Chain_USB (24 pins), BOOT_JTAG_AUX (21 pins), POWER_GEN (15 pins), DD2088PoE_Daisy_Chain_IMU (10 pins), RJ45_1 (7 pins), RJ45_2 (7 pins), DD2088PoE_Daisy_Chain_CAM (42 pins), Ethernet_Switch (55 pins), PoE_Si3404 (10 pins)
VBUS: CONNECTOR_B (J3.80), DD2088PoE_Daisy_Chain_USB (14 pins)
VNEG_IN: RJ45_1 (6 pins), PoE_Si3404 (C33.1 FB3.1 NT1.1)
2485_PGOOD: CONNECTOR_A (J2.37), BOOT_JTAG_AUX (J5.5 Q2.1)
2485_WAKEUP: CONNECTOR_A (J2.41), BOOT_JTAG_AUX (J5.7 R1.2 R62.1)
BNO08x_BOOTN_1V8: CONNECTOR_B (J3.42), DD2088PoE_Daisy_Chain_IMU (R84.2)
BNO08x_CIPO_1V8: CONNECTOR_A (J2.64 TP28.1), DD2088PoE_Daisy_Chain_IMU (U12.20)
BNO08x_COPI_1V8: CONNECTOR_A (J2.62 TP29.1), DD2088PoE_Daisy_Chain_IMU (U12.17)
BNO08x_CS_1V8: CONNECTOR_A (J2.60 TP30.1), DD2088PoE_Daisy_Chain_IMU (U12.18)
BNO08x_INT_1V8: CONNECTOR_A (J2.69), DD2088PoE_Daisy_Chain_IMU (TP25.1 U12.14)
BNO08x_RSTn_1V8: CONNECTOR_B (J3.44), DD2088PoE_Daisy_Chain_IMU (TP19.1 U12.11)
BNO08x_SCK_1V8: CONNECTOR_A (J2.74 TP27.1), DD2088PoE_Daisy_Chain_IMU (U12.19)
BOOT0: CONNECTOR_B (J3.26), BOOT_JTAG_AUX (R23.1 SW1.6)
BOOT1: CONNECTOR_B (J3.24), BOOT_JTAG_AUX (R22.1 SW1.5)
BOOT2: CONNECTOR_B (J3.22), BOOT_JTAG_AUX (R21.1 SW1.4)
BOOT3: CONNECTOR_B (J3.20), BOOT_JTAG_AUX (R20.1 SW1.3)
BOOT4: CONNECTOR_B (J3.18), BOOT_JTAG_AUX (R19.1 SW1.2)
BRIDGE_REFCLK_N: ETH_PCIE_PHY (U4.16), PCIE_CLK (R33.1 R43.2)
BRIDGE_REFCLK_P: ETH_PCIE_PHY (U4.15), PCIE_CLK (R42.2 R65.1)
CAM_A_CLK_OUT: CONNECTOR_A (J2.28), DD2088PoE_Daisy_Chain_CAM (D27.5 D27.6 J9.18 TP32.1)
CAM_A_PWDN_N: CONNECTOR_A (J2.34), DD2088PoE_Daisy_Chain_CAM (D27.4 D27.7 J9.17 TP37.1)
CAM_B_CLK_OUT: CONNECTOR_A (J2.73), DD2088PoE_Daisy_Chain_CAM (8 pins)
CAM_B_D_PWM: CONNECTOR_A (J2.65), DD2088PoE_Daisy_Chain_CAM (D28.4 D28.7 J8.17 TP36.1)
CAM_B_PWDN_N: CONNECTOR_A (J2.67), DD2088PoE_Daisy_Chain_CAM (D24.4 D24.7 J6.17 TP35.1)
CAM_L_C_N: CONNECTOR_A (J2.95), DD2088PoE_Daisy_Chain_CAM (D24.1 D24.10 J6.8)
CAM_L_C_P: CONNECTOR_A (J2.97), DD2088PoE_Daisy_Chain_CAM (D24.2 D24.9 J6.9)
CAM_L_D0_N: CONNECTOR_A (J2.89), DD2088PoE_Daisy_Chain_CAM (D22.1 D22.10 J6.2)
CAM_L_D0_P: CONNECTOR_A (J2.91), DD2088PoE_Daisy_Chain_CAM (D22.2 D22.9 J6.3)
CAM_L_D1_N: CONNECTOR_A (J2.83), DD2088PoE_Daisy_Chain_CAM (D22.4 D22.7 J6.5)
CAM_L_D1_P: CONNECTOR_A (J2.85), DD2088PoE_Daisy_Chain_CAM (D22.5 D22.6 J6.6)
CAM_R_C_N: CONNECTOR_A (J2.96), DD2088PoE_Daisy_Chain_CAM (D28.1 D28.10 J8.8)
CAM_R_C_P: CONNECTOR_A (J2.98), DD2088PoE_Daisy_Chain_CAM (D28.2 D28.9 J8.9)
CAM_R_D0_N: CONNECTOR_A (J2.90), DD2088PoE_Daisy_Chain_CAM (D26.1 D26.10 J8.2)
CAM_R_D0_P: CONNECTOR_A (J2.92), DD2088PoE_Daisy_Chain_CAM (D26.2 D26.9 J8.3)
CAM_R_D1_N: CONNECTOR_A (J2.84), DD2088PoE_Daisy_Chain_CAM (D26.4 D26.7 J8.5)
CAM_R_D1_P: CONNECTOR_A (J2.86), DD2088PoE_Daisy_Chain_CAM (D26.5 D26.6 J8.6)
COM_AUX_IO2: CONNECTOR_A (J2.42), DD2088PoE_Daisy_Chain_CAM (R82.1)
GPIO7/sd_hst_cd: CONNECTOR_A (J2.59), BOOT_JTAG_AUX (R66.2)
GPIO58: CONNECTOR_B (J3.28 R27.1), BOOT_JTAG_AUX (R63.1 SW1.1)
I2C0_SCL: CONNECTOR_B (J3.34), BOOT_JTAG_AUX (TP1.1)
I2C0_SDA: CONNECTOR_B (J3.36), BOOT_JTAG_AUX (TP2.1)
I2C1_SCL: CONNECTOR_A (J2.35), DD2088PoE_Daisy_Chain_CAM (J9.20)
I2C1_SDA: CONNECTOR_A (J2.33), DD2088PoE_Daisy_Chain_CAM (J9.21)
I2C2_SCL: CONNECTOR_A (J2.77), DD2088PoE_Daisy_Chain_CAM (J6.20 J8.20)
I2C2_SDA: CONNECTOR_A (J2.79), DD2088PoE_Daisy_Chain_CAM (J6.21 J8.21)
I2C3_SCL: CONNECTOR_A (J2.78), BOOT_JTAG_AUX (J5.2)
I2C3_SDA: CONNECTOR_A (J2.80), BOOT_JTAG_AUX (J5.4)
I2C4_SCL_1V8: CONNECTOR_B (J3.59), PCIE_CLK (U3.5)
I2C4_SDA_1V8: CONNECTOR_B (J3.57), PCIE_CLK (U3.4)
LED1_0: ETH_PCIE_PHY (R74.1), Ethernet_Switch (U15.105)
LED1_1: ETH_PCIE_PHY (R73.1), Ethernet_Switch (R90.2 U15.106)
LED3_0: RJ45_1 (R58.1), Ethernet_Switch (U15.85)
LED3_1: RJ45_1 (R59.1), Ethernet_Switch (R95.2 U15.86)
LED4_0: RJ45_2 (R97.1), Ethernet_Switch (R92.2 U15.82)
LED4_1: RJ45_2 (R98.1), Ethernet_Switch (R94.2 U15.83)
MIPI_C_N: CONNECTOR_A (J2.3), DD2088PoE_Daisy_Chain_CAM (D25.1 D25.10 J9.8)
MIPI_C_P: CONNECTOR_A (J2.5), DD2088PoE_Daisy_Chain_CAM (D25.2 D25.9 J9.9)
MIPI_D0_N: CONNECTOR_A (J2.9), DD2088PoE_Daisy_Chain_CAM (D23.1 D23.10 J9.2)
MIPI_D0_P: CONNECTOR_A (J2.11), DD2088PoE_Daisy_Chain_CAM (D23.2 D23.9 J9.3)
MIPI_D1_N: CONNECTOR_A (J2.15), DD2088PoE_Daisy_Chain_CAM (D23.4 D23.7 J9.5)
MIPI_D1_P: CONNECTOR_A (J2.17), DD2088PoE_Daisy_Chain_CAM (D23.5 D23.6 J9.6)
MIPI_D2_N: CONNECTOR_A (J2.21), DD2088PoE_Daisy_Chain_CAM (D25.4 D25.7 J9.11)
MIPI_D2_P: CONNECTOR_A (J2.23), DD2088PoE_Daisy_Chain_CAM (D25.5 D25.6 J9.12)
MIPI_D3_N: CONNECTOR_A (J2.27), DD2088PoE_Daisy_Chain_CAM (D27.1 D27.10 J9.14)
MIPI_D3_P: CONNECTOR_A (J2.29), DD2088PoE_Daisy_Chain_CAM (D27.2 D27.9 J9.15)
MODULE_nRST: CONNECTOR_A (B1.2 J2.39), BOOT_JTAG_AUX (J5.1 Q4.1)
PCIe_CLKREQ_N_1V8: CONNECTOR_B (J3.65), ETH_PCIE_PHY (U6.4)
PCIe_ISOLATE_N_1V8: CONNECTOR_B (R27.2), ETH_PCIE_PHY (U6.5)
PCIe_PERST_1V8: CONNECTOR_B (J3.63), ETH_PCIE_PHY (Q1.1)
sd_hst0_clk: CONNECTOR_A (J2.61), BOOT_JTAG_AUX (J7.5)
sd_hst0_cmd: CONNECTOR_A (J2.63), BOOT_JTAG_AUX (J7.3)
sd_hst0_dat_0: CONNECTOR_A (J2.40), BOOT_JTAG_AUX (J7.7)
sd_hst0_dat_1: CONNECTOR_A (J2.38), BOOT_JTAG_AUX (J7.8)
sd_hst0_dat_2: CONNECTOR_A (J2.36), BOOT_JTAG_AUX (J7.1)
sd_hst0_dat_3: CONNECTOR_A (J2.32), BOOT_JTAG_AUX (J7.2)
SDS_IO_CLKI_N: CONNECTOR_B (J3.81), PCIE_CLK (R36.1 R41.2)
SDS_IO_CLKI_P: CONNECTOR_B (J3.83), PCIE_CLK (R34.1 R40.1)
SDS_RXD_N: CONNECTOR_B (J3.77), ETH_PCIE_PHY (C51.1)
SDS_RXD_P: CONNECTOR_B (J3.75), ETH_PCIE_PHY (C35.1)
SDS_TXD_N: CONNECTOR_B (J3.71), ETH_PCIE_PHY (U4.14)
SDS_TXD_P: CONNECTOR_B (J3.69), ETH_PCIE_PHY (U4.13)
SYS_RST: CONNECTOR_B (J3.89), BOOT_JTAG_AUX (J4.6)
TCK: CONNECTOR_B (J3.97), BOOT_JTAG_AUX (J4.2)
TDI: CONNECTOR_B (J3.95), BOOT_JTAG_AUX (J4.3)
TDO: CONNECTOR_B (J3.91), BOOT_JTAG_AUX (J4.5)
TMS: CONNECTOR_B (J3.99), BOOT_JTAG_AUX (J4.1)
TRST: CONNECTOR_B (J3.93), BOOT_JTAG_AUX (J4.4)
TXRX1A_N: ETH_PCIE_PHY (U4.2), Ethernet_Switch (U15.2)
TXRX1A_P: ETH_PCIE_PHY (U4.1), Ethernet_Switch (U15.1)
TXRX1B_N: ETH_PCIE_PHY (U4.5), Ethernet_Switch (U15.5)
TXRX1B_P: ETH_PCIE_PHY (U4.4), Ethernet_Switch (U15.4)
TXRX1C_N: ETH_PCIE_PHY (U4.7), Ethernet_Switch (U15.7)
TXRX1C_P: ETH_PCIE_PHY (U4.6), Ethernet_Switch (U15.6)
TXRX1D_N: ETH_PCIE_PHY (U4.10), Ethernet_Switch (U15.9)
TXRX1D_P: ETH_PCIE_PHY (U4.9), Ethernet_Switch (U15.8)
TXRX3A_N: RJ45_1 (D17.2 D17.9 J1.2), Ethernet_Switch (U15.25)
TXRX3A_P: RJ45_1 (D17.1 D17.10 J1.1), Ethernet_Switch (U15.24)
TXRX3B_N: RJ45_1 (D17.5 D17.6 J1.6), Ethernet_Switch (U15.27)
TXRX3B_P: RJ45_1 (D17.4 D17.7 J1.3), Ethernet_Switch (U15.26)
TXRX3C_N: RJ45_1 (D18.2 D18.9 J1.8), Ethernet_Switch (U15.29)
TXRX3C_P: RJ45_1 (D18.1 D18.10 J1.7), Ethernet_Switch (U15.28)
TXRX3D_N: RJ45_1 (D18.5 D18.6 J1.10), Ethernet_Switch (U15.32)
TXRX3D_P: RJ45_1 (D18.4 D18.7 J1.9), Ethernet_Switch (U15.31)
TXRX4A_N: RJ45_2 (D30.2 D30.9 J10.2), Ethernet_Switch (U15.35)
TXRX4A_P: RJ45_2 (D30.1 D30.10 J10.1), Ethernet_Switch (U15.34)
TXRX4B_N: RJ45_2 (D30.5 D30.6 J10.6), Ethernet_Switch (U15.38)
TXRX4B_P: RJ45_2 (D30.4 D30.7 J10.3), Ethernet_Switch (U15.37)
TXRX4C_N: RJ45_2 (D31.2 D31.9 J10.8), Ethernet_Switch (U15.40)
TXRX4C_P: RJ45_2 (D31.1 D31.10 J10.7), Ethernet_Switch (U15.39)
TXRX4D_N: RJ45_2 (D31.5 D31.6 J10.10), Ethernet_Switch (U15.43)
TXRX4D_P: RJ45_2 (D31.4 D31.7 J10.9), Ethernet_Switch (U15.42)
USB_D_N: CONNECTOR_B (J3.90), DD2088PoE_Daisy_Chain_USB (J14.A7 J14.B7)
USB_D_P: CONNECTOR_B (J3.92), DD2088PoE_Daisy_Chain_USB (J14.A6 J14.B6)
USB_RX_N: CONNECTOR_B (J3.96), DD2088PoE_Daisy_Chain_USB (U61.4)
USB_RX_P: CONNECTOR_B (J3.98), DD2088PoE_Daisy_Chain_USB (U61.3)
USB_TX_N: CONNECTOR_B (J3.84), DD2088PoE_Daisy_Chain_USB (U61.8)
USB_TX_P: CONNECTOR_B (J3.86), DD2088PoE_Daisy_Chain_USB (U61.7)
VNEG_OUT: RJ45_2 (J10.12 J10.14), PoE_Si3404 (NT1.2 U10.3)
VPOS_IN: RJ45_1 (6 pins), PoE_Si3404 (5 pins)
VPOS_OUT: RJ45_2 (J10.11 J10.13), PoE_Si3404 (5 pins)

## Assembly variants
Production: not fitted R1 R38 R39 R47 R66 R67 R90 R91 R92 R93 R94 R95 R96 RZ28 RZ29